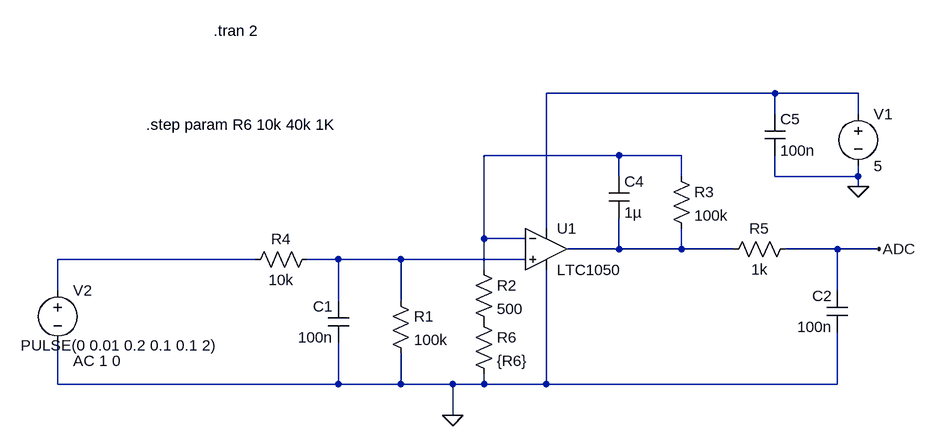
[diagram p0: schematic Projet_grindal_mariez_elec_simulation.asc]
Projet_grindal_mariez_elec_simulation.asc, the LTspice schematic file:
Version 4
SHEET 1 944 760
WIRE 720 80 368 80
WIRE 848 80 720 80
WIRE 720 112 720 80
WIRE 848 112 848 80
WIRE 480 176 272 176
WIRE 576 176 480 176
WIRE 480 208 480 176
WIRE 576 208 576 176
WIRE 720 208 720 176
WIRE 848 208 848 192
WIRE 848 208 720 208
WIRE 848 224 848 208
WIRE 368 288 368 80
WIRE 272 304 272 176
WIRE 336 304 272 304
WIRE 480 320 480 272
WIRE 480 320 400 320
WIRE 576 320 576 288
WIRE 576 320 480 320
WIRE 656 320 576 320
WIRE 816 320 736 320
WIRE 880 320 816 320
WIRE -80 336 -384 336
WIRE 48 336 0 336
WIRE 144 336 48 336
WIRE 336 336 144 336
WIRE 272 352 272 304
WIRE -384 384 -384 336
WIRE 816 384 816 320
WIRE 48 400 48 336
WIRE 144 400 144 336
WIRE -384 528 -384 464
WIRE 48 528 48 464
WIRE 48 528 -384 528
WIRE 144 528 144 480
WIRE 144 528 48 528
WIRE 224 528 144 528
WIRE 272 528 272 512
WIRE 272 528 224 528
WIRE 368 528 368 352
WIRE 368 528 272 528
WIRE 816 528 816 448
WIRE 816 528 368 528
WIRE 224 576 224 528
FLAG 224 576 0
FLAG 848 224 0
FLAG 880 320 ADC
SYMBOL cap 64 464 R180
WINDOW 0 24 56 Left 2
WINDOW 3 24 8 Left 2
SYMATTR InstName C1
SYMATTR Value 100n
SYMBOL cap 832 448 R180
WINDOW 0 24 56 Left 2
WINDOW 3 24 8 Left 2
SYMATTR InstName C2
SYMATTR Value 100n
SYMBOL cap 464 208 R0
SYMATTR InstName C4
SYMATTR Value 1µ
SYMBOL res 128 384 R0
SYMATTR InstName R1
SYMATTR Value 100k
SYMBOL res 256 416 R0
SYMATTR InstName R6
SYMATTR Value {R6}
SYMBOL res 560 192 R0
SYMATTR InstName R3
SYMATTR Value 100k
SYMBOL res 16 320 R90
WINDOW 0 0 56 VBottom 2
WINDOW 3 32 56 VTop 2
SYMATTR InstName R4
SYMATTR Value 10k
SYMBOL res 752 304 R90
WINDOW 0 0 56 VBottom 2
WINDOW 3 32 56 VTop 2
SYMATTR InstName R5
SYMATTR Value 1k
SYMBOL OpAmps\\LTC1050 368 256 R0
SYMATTR InstName U1
SYMBOL voltage 848 96 R0
WINDOW 123 0 0 Left 0
WINDOW 39 0 0 Left 0
SYMATTR InstName V1
SYMATTR Value 5
SYMBOL voltage -384 368 R0
WINDOW 123 24 124 Left 2
WINDOW 39 0 0 Left 0
WINDOW 3 -57 100 Left 2
SYMATTR Value2 AC 1 0
SYMATTR InstName V2
SYMATTR Value PULSE(0 0.01 0.2 0.1 0.1 2)
SYMBOL cap 704 112 R0
SYMATTR InstName C5
SYMATTR Value 100n
SYMBOL res 256 336 R0
SYMATTR InstName R2
SYMATTR Value 500
TEXT -144 -16 Left 2 !.tran 2
TEXT -248 128 Left 2 !.step param R6 10k 40k 1K

The netlist it stands for:
* Projet_grindal_mariez_elec_simulation.asc
C1 0 N005 100n
C2 0 ADC 100n
C4 N002 N003 1µ
R1 N005 0 100k
R6 P001 0 {R6}
R3 N002 N003 100k
R4 N005 N004 10k
R5 ADC N003 1k
XU1 N005 N002 N001 0 N003 LTC1050  ; pins In+ In- V+ V- OUT
V1 N001 0 5
V2 N004 0 PULSE(0 0.01 0.2 0.1 0.1 2) AC 1 0
C5 N001 0 100n
R2 N002 P001 500
.tran 2
.step param R6 10k 40k 1K
.lib LTC.lib
.backanno
.end